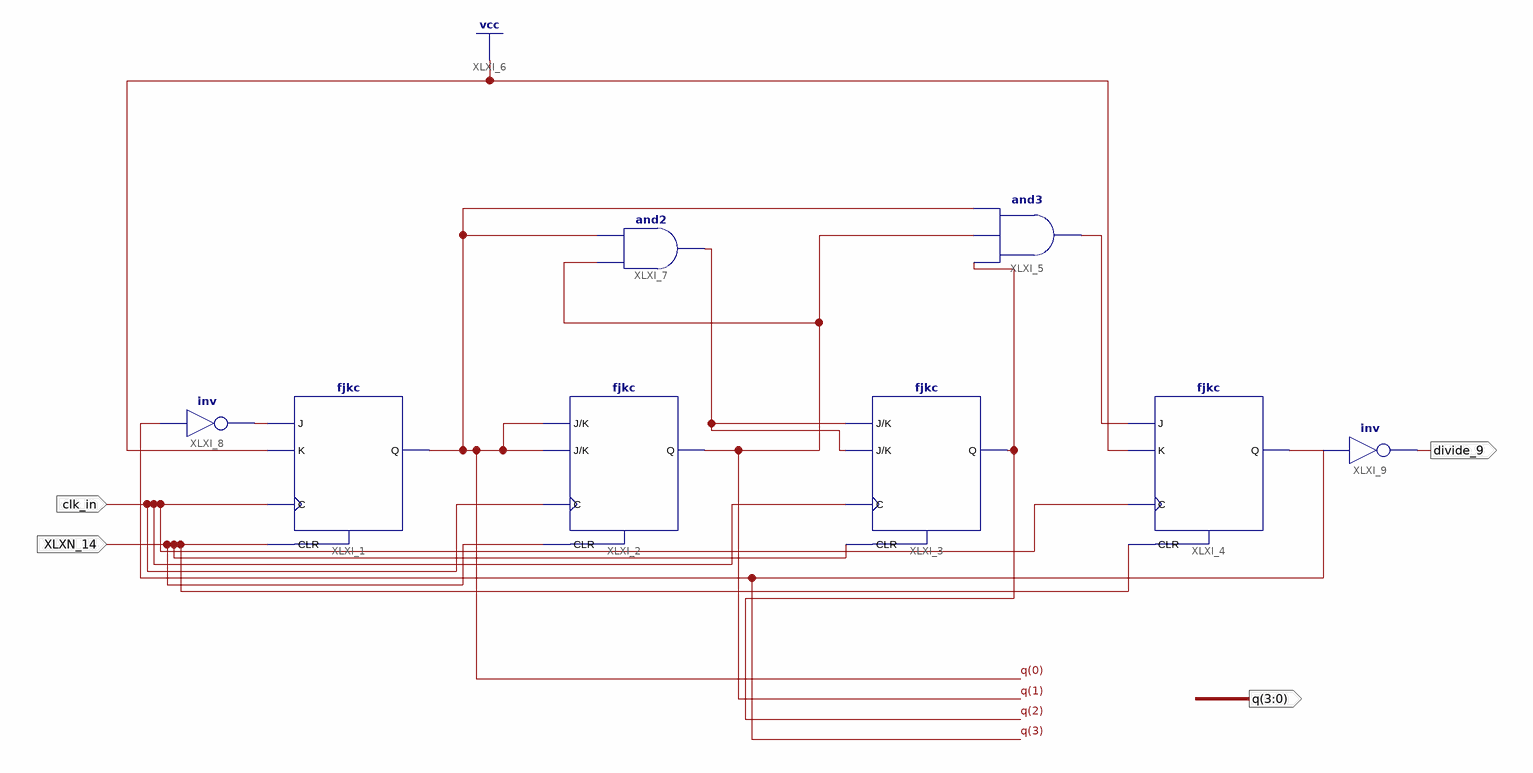
[diagram p0: schematic sheet 1]
// Xilinx ISE schematic counter08.sch (spartan6) as structural Verilog: 8 symbols, 4 ports
module counter08 (
  input  clk_in,
  input  XLXN_14,
  output divide_9,
  output [3:0] q
);

  wire XLXN_5, XLXN_8, XLXN_10;

  fjkc XLXI_1 (.C(clk_in), .CLR(XLXN_14), .J(XLXN_10), .K(1'b1), .Q(q[0]));
  fjkc XLXI_2 (.C(clk_in), .CLR(XLXN_14), .J(q[0]), .K(q[0]), .Q(q[1]));
  fjkc XLXI_3 (.C(clk_in), .CLR(XLXN_14), .J(XLXN_8), .K(XLXN_8), .Q(q[2]));
  fjkc XLXI_4 (.C(clk_in), .CLR(XLXN_14), .J(XLXN_5), .K(1'b1), .Q(q[3]));
  and XLXI_5 (XLXN_5, q[2], q[1], q[0]);
  and XLXI_7 (XLXN_8, q[1], q[0]);
  not XLXI_8 (XLXN_10, q[3]);
  not XLXI_9 (divide_9, q[3]);
endmodule
